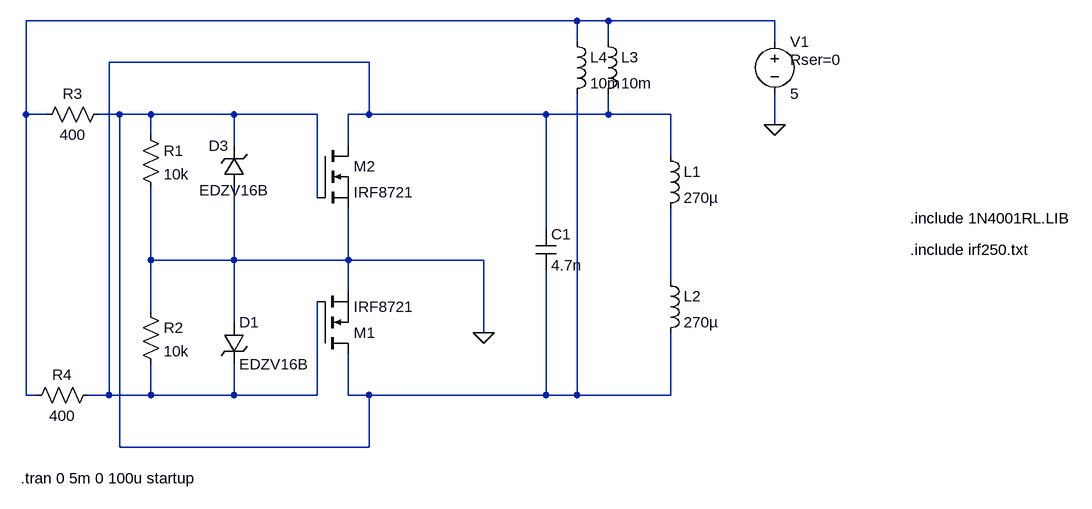
[diagram p0: schematic ZVSdriver.asc]
ZVSdriver.asc, the LTspice schematic file:
Version 4
SHEET 1 1196 680
WIRE 416 -368 -432 -368
WIRE 464 -368 416 -368
WIRE 720 -368 464 -368
WIRE 416 -336 416 -368
WIRE 464 -336 464 -368
WIRE 720 -336 720 -368
WIRE 96 -304 -304 -304
WIRE -432 -224 -432 -368
WIRE -400 -224 -432 -224
WIRE -288 -224 -320 -224
WIRE -240 -224 -288 -224
WIRE -112 -224 -240 -224
WIRE 16 -224 -112 -224
WIRE 96 -224 96 -304
WIRE 96 -224 64 -224
WIRE 368 -224 96 -224
WIRE 464 -224 464 -256
WIRE 464 -224 368 -224
WIRE 560 -224 464 -224
WIRE 720 -208 720 -256
WIRE -240 -192 -240 -224
WIRE -112 -176 -112 -224
WIRE 64 -176 64 -224
WIRE 560 -160 560 -224
WIRE 16 -96 16 -224
WIRE 368 -48 368 -224
WIRE -240 0 -240 -112
WIRE -112 0 -112 -112
WIRE -112 0 -240 0
WIRE 64 0 64 -80
WIRE 64 0 -112 0
WIRE 272 0 64 0
WIRE 560 32 560 -80
WIRE 64 48 64 0
WIRE -240 80 -240 0
WIRE -112 96 -112 0
WIRE 272 112 272 0
WIRE -432 208 -432 -224
WIRE -416 208 -432 208
WIRE -304 208 -304 -304
WIRE -304 208 -336 208
WIRE -240 208 -240 160
WIRE -240 208 -304 208
WIRE -112 208 -112 160
WIRE -112 208 -240 208
WIRE 16 208 16 64
WIRE 16 208 -112 208
WIRE 64 208 64 144
WIRE 96 208 64 208
WIRE 368 208 368 16
WIRE 368 208 96 208
WIRE 416 208 416 -256
WIRE 416 208 368 208
WIRE 560 208 560 112
WIRE 560 208 416 208
WIRE -288 288 -288 -224
WIRE 96 288 96 208
WIRE 96 288 -288 288
FLAG 272 112 0
FLAG 720 -208 0
SYMBOL nmos 16 144 M180
SYMATTR InstName M1
SYMATTR Value IRF8721
SYMBOL nmos 16 -176 R0
SYMATTR InstName M2
SYMATTR Value IRF8721
SYMBOL cap 352 -48 R0
SYMATTR InstName C1
SYMATTR Value 4.7n
SYMBOL voltage 720 -352 R0
WINDOW 123 0 0 Left 0
WINDOW 39 24 44 Left 2
SYMATTR SpiceLine Rser=0
SYMATTR InstName V1
SYMATTR Value 5
SYMBOL res -256 -208 R0
SYMATTR InstName R1
SYMATTR Value 10k
SYMBOL res -256 64 R0
SYMATTR InstName R2
SYMATTR Value 10k
SYMBOL zener -96 -112 R180
WINDOW 0 24 64 Left 2
WINDOW 3 -37 -5 Left 2
SYMATTR InstName D3
SYMATTR Value EDZV16B
SYMATTR Description Diode
SYMATTR Type diode
SYMBOL zener -128 96 R0
SYMATTR InstName D1
SYMATTR Value EDZV16B
SYMATTR Description Diode
SYMATTR Type diode
SYMBOL res -304 -240 R90
WINDOW 0 0 56 VBottom 2
WINDOW 3 32 56 VTop 2
SYMATTR InstName R3
SYMATTR Value 400
SYMBOL res -320 192 R90
WINDOW 0 0 56 VBottom 2
WINDOW 3 32 56 VTop 2
SYMATTR InstName R4
SYMATTR Value 400
SYMBOL ind 544 -176 R0
SYMATTR InstName L1
SYMATTR Value 270µ
SYMATTR SpiceLine Rser=5
SYMBOL ind 544 16 R0
SYMATTR InstName L2
SYMATTR Value 270µ
SYMATTR SpiceLine Rser=5
SYMBOL ind 448 -352 R0
SYMATTR InstName L3
SYMATTR Value 10m
SYMATTR SpiceLine Rser=0
SYMBOL ind 400 -352 R0
SYMATTR InstName L4
SYMATTR Value 10m
SYMATTR SpiceLine Rser=0
TEXT 928 -64 Left 2 !.include 1N4001RL.LIB
TEXT 928 -16 Left 2 !.include irf250.txt
TEXT -440 336 Left 2 !.tran 0 5m 0 100u startup

The netlist it stands for:
* ZVSdriver.asc
M1 N003 N002 0 0 IRF8721
M2 N002 N003 0 0 IRF8721
C1 N002 N003 4.7n
V1 N001 0 5 Rser=0
R1 N003 0 10k
R2 0 N002 10k
D3 0 N003 EDZV16B
D1 0 N002 EDZV16B
R3 N003 N001 400
R4 N002 N001 400
L1 N002 N004 270µ Rser=5
L2 N004 N003 270µ Rser=5
L3 N001 N002 10m Rser=0
L4 N001 N003 10m Rser=0
.model D D
.lib standard.dio
.model NMOS NMOS
.model PMOS PMOS
.lib standard.mos
.include 1N4001RL.LIB
.include irf250.txt
.tran 0 5m 0 100u startup
.backanno
.end